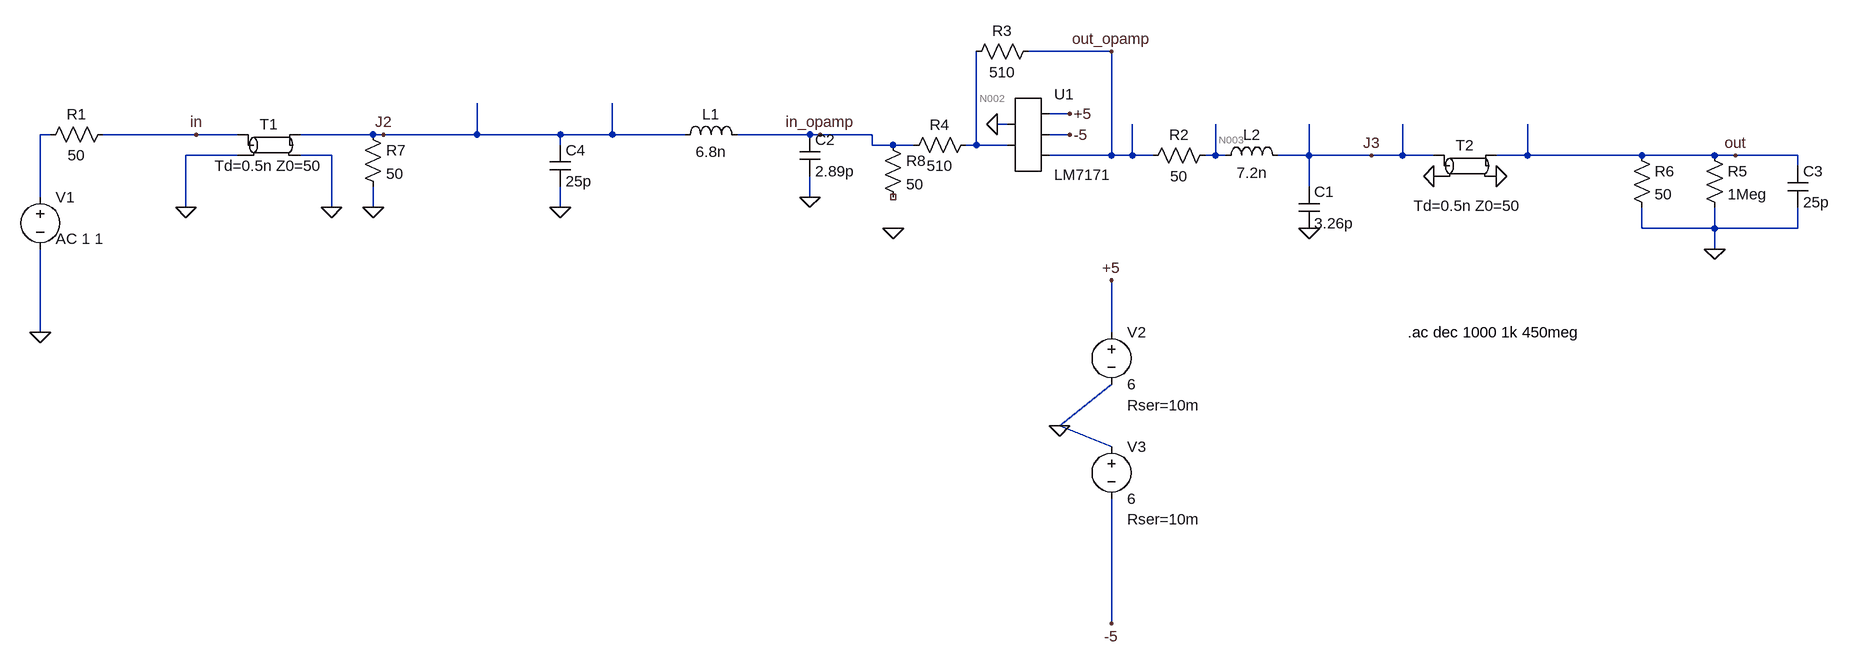
[diagram p0: schematic Symulacja drogi pomiaru2_21052026.asc]
* Symulacja drogi pomiaru2_21052026.asc
R1 in N001 50
T1 in 0 J2 0 Td=0.5n Z0=50
L1 J2 in_opamp 6.8n Rser=1m
L2 N003 J3 7.2n Rser=1m
C1 J3 0 3.26p
R2 N003 out_opamp 50
T2 J3 0 out 0 Td=0.5n Z0=50
C2 in_opamp 0 2.89p
* U1: LM7171 (symbol AutoGenerated\LM7171 not available, pins judged from their places): pin1=0 pin2=N002 pin3=+5 pin4=-5 pin5=out_opamp
V2 +5 0 6 Rser=10m
V3 0 -5 6 Rser=10m
R3 out_opamp N002 510
R4 N002 in_opamp 510
R5 out 0 1Meg
C3 out 0 25p
V1 N001 0 AC 1 1
R6 out 0 50
R7 J2 0 50
R8 in_opamp NC_01 50
C4 J2 0 25p
.ac dec 1000 1k 450meg
.backanno
.end

* Results of the author's LTspice run, read from the files saved beside the schematic
* Operating Point, zero values left out:
*   V(+5) = 6 V
*   V(-5) = -6 V
*   V(in) = 43.88 µV
*   V(in_opamp) = 43.89 µV
*   V(j2) = 43.88 µV
*   V(j3) = 1.673 mV
*   V(n002) = 939.1 µV
*   V(n003) = 1.673 mV
*   V(out) = 1.673 mV
*   V(out_opamp) = 3.346 mV
*   I(L1) = -1.755 µA
*   I(L2) = 33.46 µA
*   I(R1) = 877.7 nA
*   I(R2) = -33.46 µA
*   I(R3) = 4.72 µA
*   I(R4) = 1.755 µA
*   I(R5) = 1.673 nA
*   I(R6) = 33.46 µA
*   I(R7) = 877.7 nA
*   I(V1) = 877.7 nA
*   I(V2) = -5.818 mA
*   I(V3) = -5.786 mA
*   Ia(T1) = -877.7 nA
*   Ia(T2) = 33.46 µA
*   Ib(T1) = 877.7 nA
*   Ib(T2) = -33.46 µA
*   Ic(T1) = 877.7 nA
*   Ic(T2) = -33.46 µA
*   Id(T1) = -877.7 nA
*   Id(T2) = 33.46 µA
*   Ix(u1:2) = 2.964 µA
*   Ix(u1:3) = 3.065 µA
*   Ix(u1:4) = 5.818 mA
*   Ix(u1:5) = -5.786 mA
*   Ix(u1:6) = -38.18 µA
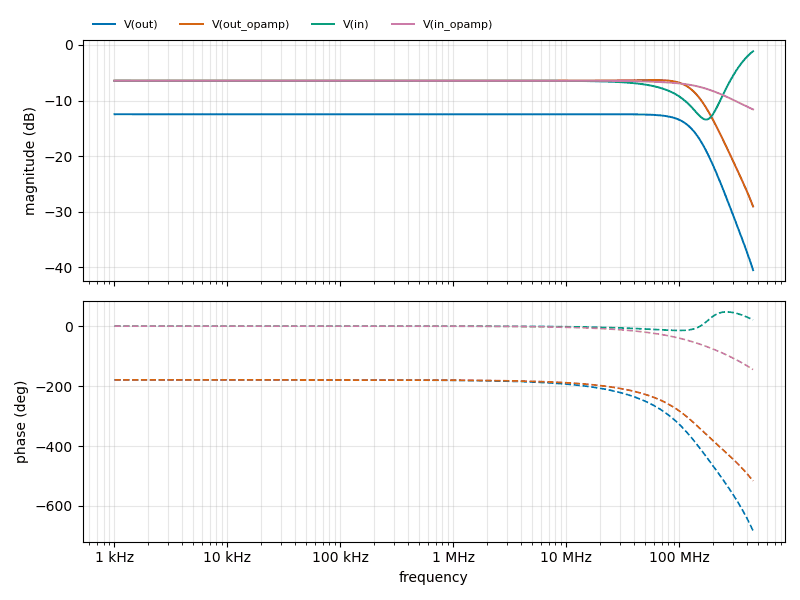
[diagram p1: AC Analysis of Symulacja drogi pomiaru2_21052026.asc, plotted from the saved traces]
* AC Analysis, 1 run:
*   V(out): -12.46 dB at 1 kHz, -40.48 dB at 450 MHz, peak -12.46 dB at 1.026 kHz, 3 dB below the peak at 133.7 MHz
*   V(out_opamp): -6.44 dB at 1 kHz, -29.03 dB at 450 MHz, peak -6.32 dB at 58.34 MHz, 3 dB below the peak at 147.9 MHz
*   V(in): -6.44 dB at 1 kHz, -1.15 dB at 450 MHz, peak -1.15 dB at 450 MHz, 3 dB below the peak at 330.4 MHz
*   V(in_opamp): -6.44 dB at 1 kHz, -11.59 dB at 450 MHz, peak -6.44 dB at 1.148 kHz, 3 dB below the peak at 270.7 MHz